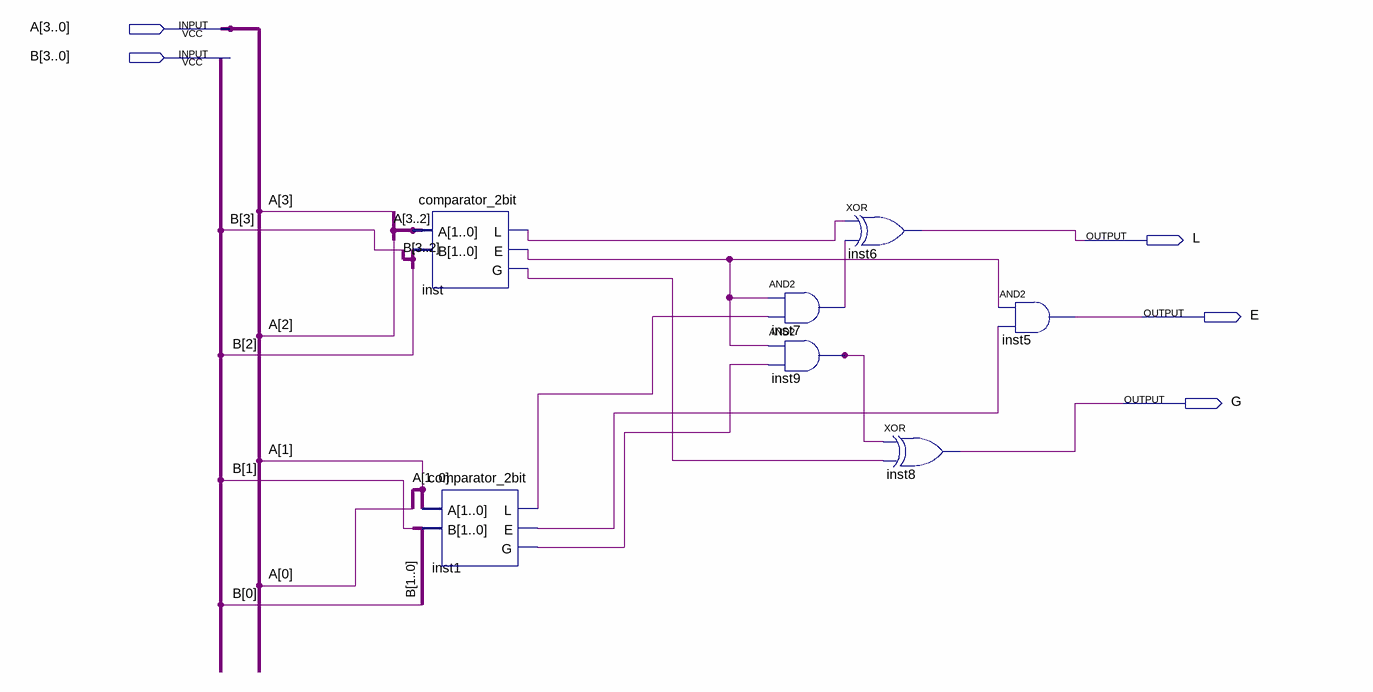
[diagram p0: schematic sheet]
// Quartus schematic comparator_4bit.bdf as structural Verilog: 7 symbols, 5 pins
module comparator_4bit (
  input  [3:0] A,
  input  [3:0] B,
  output L,
  output E,
  output G
);

  wire inst1_e, inst1_g, inst1_l, inst7_out, inst9_out, inst_e, inst_g, inst_l;

  comparator_2bit inst (.A(A[3:2]), .B(B[3:2]), .L(inst_l), .E(inst_e), .G(inst_g));
  comparator_2bit inst1 (.A(A[1:0]), .B(B[1:0]), .L(inst1_l), .E(inst1_e), .G(inst1_g));
  and inst7 (inst7_out, inst_e, inst1_l);
  and inst9 (inst9_out, inst_e, inst1_g);
  xor inst6 (L, inst_l, inst7_out);
  xor inst8 (G, inst9_out, inst_g);
  and inst5 (E, inst_e, inst1_e);
endmodule
